# Altium project Charge Controller.PrjPcb
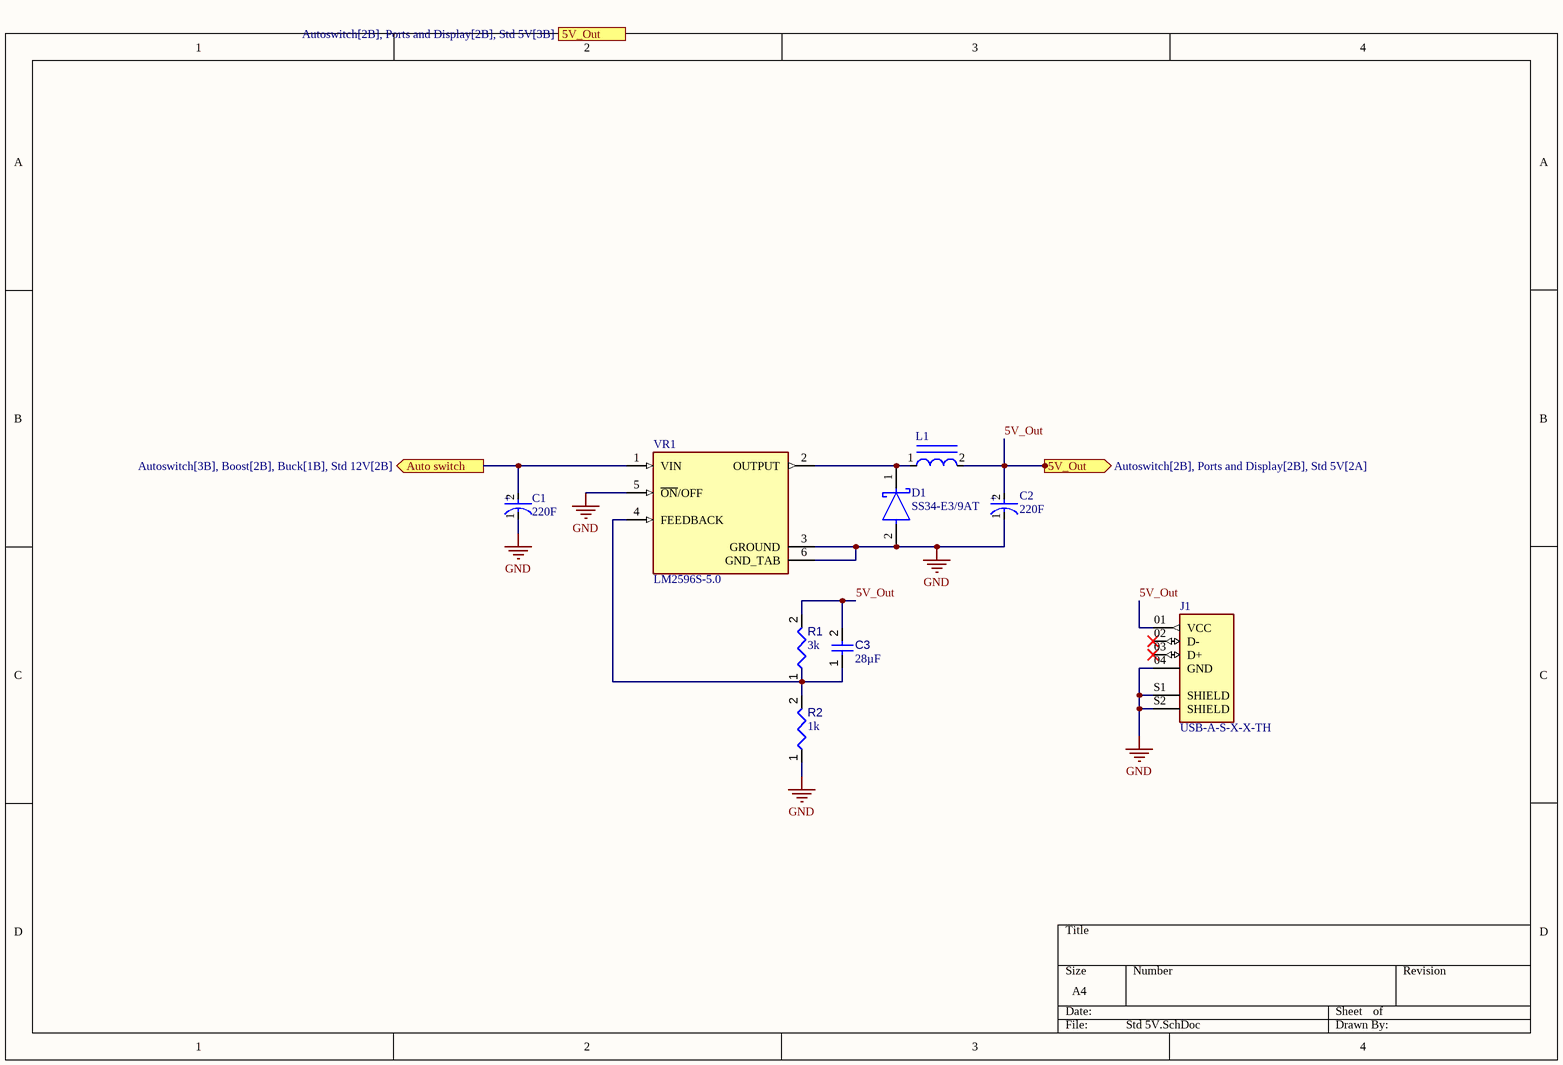
[diagram p0: Std 5V.SchDoc]
6 sheets, 49 parts. Net scope: flat (ports and power ports of the same name join across sheets).
Board file: Layout.PcbDoc
Sheets:
  Std 5V.SchDoc
  Buck.SchDoc
  Autoswitch.SchDoc
  Boost.SchDoc
  Ports and Display.SchDoc
  Std 12V.SchDoc

## Sheet Std 5V.SchDoc
size A4; SheetNumber: 1; SheetTotal: 6

### Parts
C1  value 220F  [FP-FTF-MFG]  (hidden comment: Capacitors)
C2  value 220F  [FP-FTF-MFG]  (hidden comment: Capacitors)
C3  value 28µF  [CAPC0805(2012)145_L]  (hidden comment: Capacitor 47µF +/-40% 6.3V 0805)
D1  SS34-E3/9AT  [FP-SMC-MFG]
J1  USB-A-S-X-X-TH  [SAMTEC_USB-A-S-X-X-TH]
L1  DR127-330-R  [FP-DR127-MFG]  (value not drawn)
R1  value 3k  [RESC0805(2012)_L]  (hidden comment: 1KR5J)
R2  value 1k  [RESC0805(2012)_L]  (hidden comment: 1KR5J)
VR1  LM2596S-5.0  [TO170P1524X483-6N]

### Ports
5V_Out (out, see Autoswitch[2B], Ports and Display[2B], Std 5V[2A]), 5V_Out (out, see Autoswitch[2B], Ports and Display[2B], Std 5V[3B]), Auto switch (out, see Autoswitch[3B], Boost[2B], Buck[1B], Std 12V[2B])

### Nets
GND: C1.1(C) C2.1(C) D1.2(A) J1.04(GND) J1.S1(SHIELD) J1.S2(SHIELD) R2.1 VR1.3(GROUND) VR1.5(~{ON}/OFF) VR1.6(GND_TAB)
5V_Out: C2.2(A) C3.2 J1.01(VCC) L1.2 R1.2 ; port 5V_Out
NetC1_2: C1.2(A) VR1.1(VIN) ; port Auto switch
NetC3_1: C3.1 R1.1 R2.2 VR1.4(FEEDBACK)
NetD1_1: D1.1(C) L1.1 VR1.2(OUTPUT)

Not connected (* = marked no-connect by the designer): J1 02(D-)* 03(D+)*

### Notes on the sheet
- (in symbol CMP-001-00083-1) +

### Library data of the parts
C1 C2 = CMP-001-00083-1: Aluminum Electrolytic Capacitor, Polarized, Aluminum (wet), 50V, 20% +Tol, 20% -Tol, 220uF, Surface Mount, 3333; Dielectric Material: Aluminium; Ripple Current: 435.5mA; Tan Delta: 0.1; ESR (Equivalent Series Resistance): 180mR; Reference Standard: AEC-Q200; Leakage Current: 110uA; RoHS Compliant: Yes; Tolerance (fill in as +-): 20%; Length: 10.2mm; Rated DC Voltage (URdc): 50V; Min Operating Temperature: -55°C; Packaging: Tape and Reel; Max Operating Temperature: 105°C; Case/Package: 3333; Tolerance  (fill in as +-): 20%; Capacitor Type: Aluminium; Termination: Flat; Reach SVHC Compliant: Yes; Pins: 2; Polarity: Polarized; Package Style: SMTMeter; Mounting Technology: Surface Mount; Diameter: 8mm
C3 = CMP-001-00082-4: Chip Capacitor, 47µF +/-40%, 6.3V, 0805, Thickness 1.45 mm; Tolerance: 10%; Min Operating Temperature: -55°C; Max Operating Temperature: 85°C; Case/Package: 0805; Pins: 2; Mounting Technology: SMT; Voltage Rating: 6.3V
D1 = CMP-004-00032-1: Rectifier Diode, Schottky, 1 Phase, 1 Element, 3A, 40V V(RRM), Silicon, DO-214AB; Max Reverse Current: 500uA; Time @ Peak Reflow Temperature-Max (s): 40s; Case Connection: CATHODE; Qualification Status: Not Qualified; Non-rep Pk Forward Current-Max: 100A; Number of Phases: 1; Package Body Material: Plastic; Application(s): EFFICIENCY; Forward Voltage: 500mV; Diode Type: RECTIFIER; Max Output current: 3A; Peak Reflow Temperature (Cel): 260°C; Package Shape: Rectangular; Terminal Position: DUAL; Terminal Finish: Tin; Min Operating Temperature: -55°C; Max Operating Temperature: 150°C; Diode Element Material: SILICON; Package Style: SMALL OUTLINEMeter; Technology: SCHOTTKY; Number of Elements: 1; Moisture Sensitivity Level: 1; Surface Mount: Yes; JESD-30 Code: R-PDSO-C2; RoHS Compliant: Yes; Rep Pk Reverse Voltage-Max: 40V; Terminal Form: C BEND; Pins: 2; JESD-609 Code: e3; JEDEC-95 Code: DO-214AB; Reach SVHC Compliant: No
J1 = CMP-035-000000-2: USB Connectors USB 2.0 Interface, Type A; MF: Samtec; MP: USB-A-S-F-B-TH-TR; Check_prices: https://www.snapeda.com/parts/USB-A-S-F-B-TH-TR/Samtec/view-part/?ref=eda; Purchase-URL: https://pricing.snapeda.com/search/part/USB-A-S-F-B-TH-TR/?ref=eda; SnapEDA_Link: https://www.snapeda.com/parts/USB-A-S-F-B-TH-TR/Samtec/view-part/?ref=snap; Design Item ID: USB-A-S-X-X-TH; Value: *; Component Type: Standard; Package: None; Source: USB-A-S-X-X-TH.SchLib; Availability: In Stock; Price: None; Pin Count: 6
L1 = CMP-006-00021-1: General Purpose Inductor, 33uH, 20%, 1 Element, Ferrite-Core, SMD, 4949; Package Width: 12.5mm; Case/Size Code: 4949; Shape/Size Description: RECTANGULAR PACKAGE; Inductor Application: DC-DC CONVERTER; Channels: 1; Test Frequency: 100kHz; Package Height: 8mm; Shielding: Shielded; Max Current Rating: 3.23A; DC Resistance (DCR): 60mR; Reach SVHC Compliant: Yes; Surface Mount: Yes; Max Operating Temperature: 125°C; Terminal Placement: Dual Ended; JESD-609 Code: e3; Package Style: SMTMeter; Inductance-Nom (L): 33uH; Package Length: 12.5mm; Tolerance: 20%; RoHS Compliant: Yes; Termination: One Surface; Inductor Type: GENERAL PURPOSE INDUCTOR; Pins: 2; Core Material: Ferrite; Terminal Finish: Nickel; Min Operating Temperature: -40°C; Packaging: Tape and Reel; Construction: Magnetic Shielded
R1 R2 = CMP-009-00076-2: 1K 0.125W 5% 0805 (2012 Metric)  SMD; Power: 125mW; Pins: 2; Mounting Technology: SMT; Tolerance: 5%; Case/Package: 0805
VR1 = CMP-003-000000-1: SIMPLE SWITCHER&reg; 4.5V to 40V, 3A Low Component Count Step-Down Regulator; MF: Texas Instruments; MP: LM2596S-5.0/NOPB; Source: LM2596S-5.0.SchLib; Component Type: Standard; Package: TO-263-5 Texas Instruments; Check_prices: https://www.snapeda.com/parts/LM2596S-5.0/NOPB/Texas+Instruments/view-part/?ref=eda; Value: *; Availability: In Stock; SnapEDA_Link: https://www.snapeda.com/parts/LM2596S-5.0/NOPB/Texas+Instruments/view-part/?ref=snap; Design Item ID: LM2596S-5.0; Pin Count: 6; Purchase-URL: https://pricing.snapeda.com/search/part/LM2596S-5.0/NOPB/?ref=eda; Price: None

## Sheet Buck.SchDoc
size A4; SheetNumber: 2; SheetTotal: 6
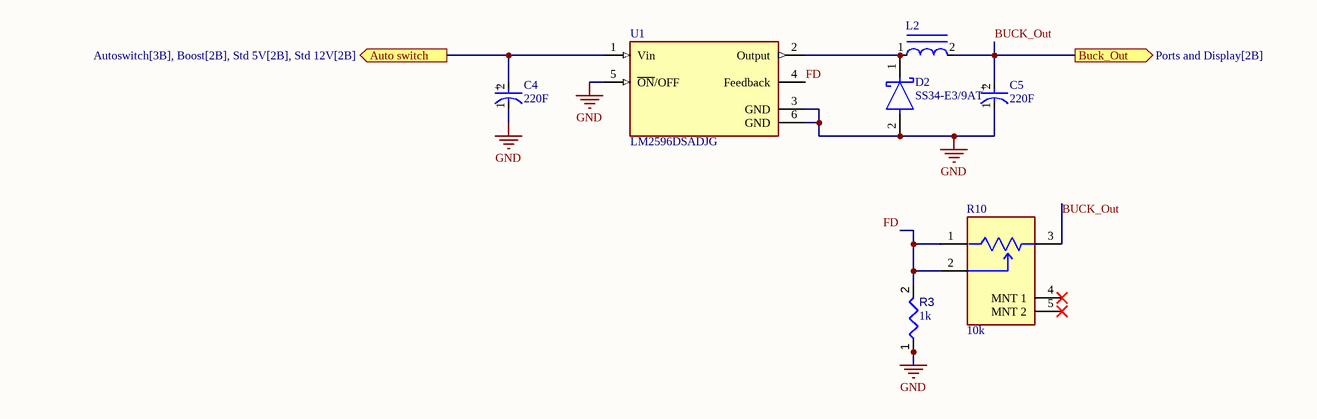
[diagram p1: Buck.SchDoc]

### Parts
C4  value 220F  [FP-FTF-MFG]  (hidden comment: Capacitors)
C5  value 220F  [FP-FTF-MFG]  (hidden comment: Capacitors)
D2  SS34-E3/9AT  [FP-SMC-MFG]
L2  DR127-330-R  [FP-DR127-MFG]  (value not drawn)
R3  value 1k  [RESC0805(2012)_L]  (hidden comment: 1KR5J)
R10  value 10k  [FP-PTV09A-4-MFG]  (hidden comment: PTV09A-4225F-B103)
U1  LM2596DSADJG  [FP-936A-02-MFG]

### Ports
Auto switch (out, see Autoswitch[3B], Boost[2B], Std 5V[2B], Std 12V[2B]), Buck_Out (out, see Ports and Display[2B])

### Nets
GND: C4.1(C) C5.1(C) D2.2(A) R3.1 U1.3(GND) U1.5(~{ON}/OFF) U1.6(GND)
BUCK_Out: C5.2(A) L2.2 R10.3 ; port Buck_Out
FD: R3.2 R10.1 R10.2 U1.4(Feedback)
NetC1_2: C4.2(A) U1.1(Vin) ; port Auto switch
NetD2_1: D2.1(C) L2.1 U1.2(Output)

Not connected (* = marked no-connect by the designer): R10 4(MNT_1)* 5(MNT_2)*

### Notes on the sheet
- (in symbol CMP-001-00083-1) +

### Library data of the parts
C4 C5 = CMP-001-00083-1: as C1 on sheet Std 5V; RoHS Compliant: Yes; Tolerance (fill in as +-): 20%; Length: 10.2mm; Rated DC Voltage (URdc): 50V; Min Operating Temperature: -55°C; Packaging: Tape and Reel; Max Operating Temperature: 105°C; Case/Package: 3333; Tolerance  (fill in as +-): 20%; Capacitor Type: Aluminium; Termination: Flat; Reach SVHC Compliant: Yes; Pins: 2; Polarity: Polarized; Package Style: SMTMeter; Mounting Technology: Surface Mount; Diameter: 8mm
D2 = CMP-004-00032-1: as D1 on sheet Std 5V; Diode Type: RECTIFIER; Max Output current: 3A; Peak Reflow Temperature (Cel): 260°C; Package Shape: Rectangular; Terminal Position: DUAL; Terminal Finish: Tin; Min Operating Temperature: -55°C; Max Operating Temperature: 150°C; Diode Element Material: SILICON; Package Style: SMALL OUTLINEMeter; Technology: SCHOTTKY; Number of Elements: 1; Moisture Sensitivity Level: 1; Surface Mount: Yes; JESD-30 Code: R-PDSO-C2; RoHS Compliant: Yes; Rep Pk Reverse Voltage-Max: 40V; Terminal Form: C BEND; Pins: 2; JESD-609 Code: e3; JEDEC-95 Code: DO-214AB; Reach SVHC Compliant: No
L2 = CMP-006-00021-1: as L1 on sheet Std 5V; Reach SVHC Compliant: Yes; Surface Mount: Yes; Max Operating Temperature: 125°C; Terminal Placement: Dual Ended; JESD-609 Code: e3; Package Style: SMTMeter; Inductance-Nom (L): 33uH; Package Length: 12.5mm; Tolerance: 20%; RoHS Compliant: Yes; Termination: One Surface; Inductor Type: GENERAL PURPOSE INDUCTOR; Pins: 2; Core Material: Ferrite; Terminal Finish: Nickel; Min Operating Temperature: -40°C; Packaging: Tape and Reel; Construction: Magnetic Shielded
R3 = CMP-009-00076-2: as R1 on sheet Std 5V; Pins: 2; Mounting Technology: SMT; Tolerance: 5%; Case/Package: 0805
R10 = CMP-009-00177-1: Potentiometer, Carbon, 0.05W, 10000ohm, 20V, 20% +/-Tol, 3943; Package Length: 9.8mm; Rotational Angle: 280°; Package Width: 11mm; Package Height: 6.8mm; Power: 50mW; Min Operating Temperature: -10°C; JESD-609 Code: e3; Max Operating Temperature: 50°C; Tolerance: 20%; Terminal Finish: Copper; Construction: SQUARE; Case/Package: 3943; Reach SVHC Compliant: Yes; Working Voltage: 20V; RoHS Compliant: Yes; Technology: CARBON; Resistor Type: Potentiometer
U1 = CMP-019-00050-1: Switching Regulator, Voltage-mode, 7.5A, 180kHz Switching Freq-Max, PSSO5; Nominal Output Voltage: 5V; Qualification Status: Not Qualified; Switcher Configuration: BUCK; Min Input Voltage: 4.5V; Package Equivalence Code: SMSIP5H,.6,67TB; Package Body Material: Plastic; Channels: 1; Max Supply Voltage: 40V; Nominal Supply Voltage: 12V; Min Operating Temperature: -40°C; Package Shape: Rectangular; Terminal Finish: Tin; Moisture Sensitivity Level: 1; JESD-30 Code: R-PSSO-G5; Max Operating Temperature: 125°C; Terminal Form: Gull Wing; Temperature Grade: AUTOMOTIVE; Reach SVHC Compliant: No; JESD-609 Code: e3; Control Mode: VOLTAGE-MODE; Terminal Position: SINGLE; Package Style: SMALL OUTLINEMeter; Throw Configuration: SWITCHING REGULATOR; Terminal Pitch: 1.702mm; Surface Mount: Yes; Width: 9.1945mm; RoHS Compliant: Yes; Max Output current: 7.5A; Length: 10.02mm; Pins: 5; Frequency: 180kHz; Case/Package: HSOP

## Sheet Autoswitch.SchDoc
size A4; SheetNumber: 3; SheetTotal: 6
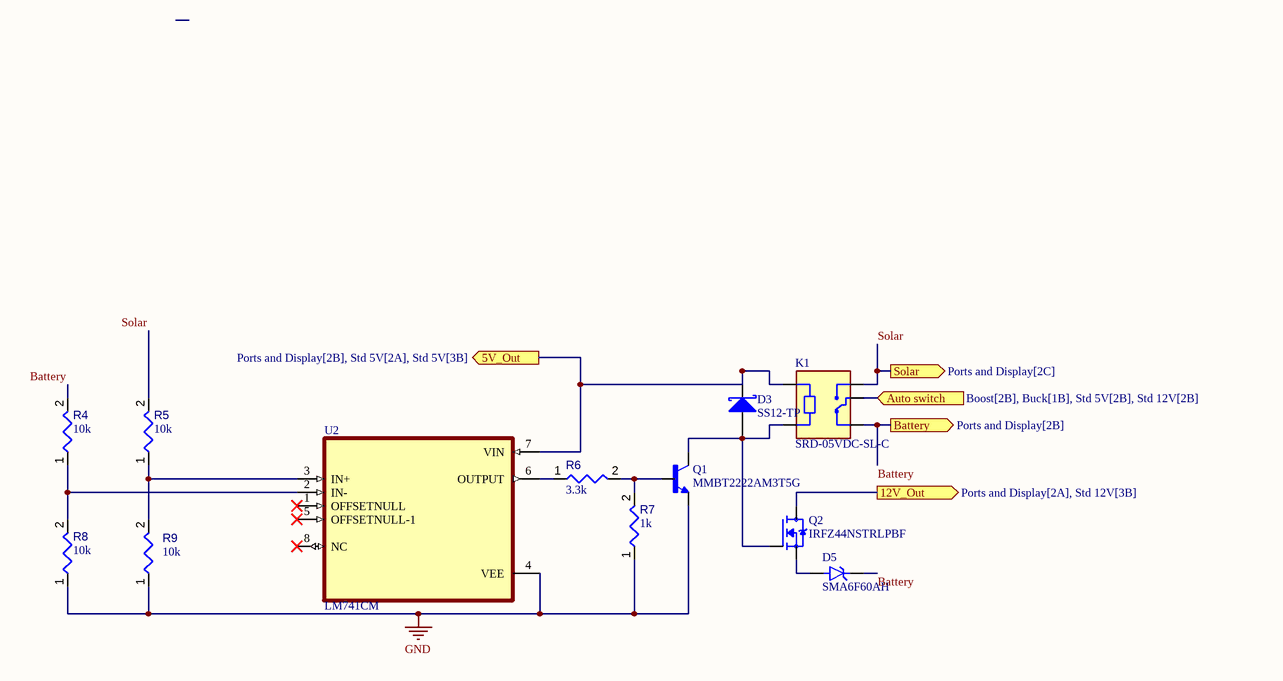
[diagram p2: Autoswitch.SchDoc]

### Parts
D3  SS12-TP  [MCC-DO-214AC-2_V]
D5  SMA6F60AH  [SODFL5226X100N]
K1  SRD-05VDC-SL-C  [RELAY_SRD-05VDC-SL-C]
Q1  MMBT2222AM3T5G  [SOT95P240X120-3N]
Q2  IRFZ44NSTRLPBF  [DPAK254P1524X483-3N]
R4  value 10k  [RESC0805(2012)_L]  (hidden comment: 1KR5J)
R5  value 10k  [RESC0805(2012)_L]  (hidden comment: 1KR5J)
R6  value 3.3k  [RESC0805(2012)_L]  (hidden comment: 1KR5J)
R7  value 1k  [RESC0805(2012)_L]  (hidden comment: 1KR5J)
R8  value 10k  [RESC0805(2012)_L]  (hidden comment: 1KR5J)
R9  value 10k  [RESC0805(2012)_L]  (hidden comment: 1KR5J)
U2  LM741CM  [SOIC127P599X175-8N]

### Ports
5V_Out (out, see Ports and Display[2B], Std 5V[2A], Std 5V[3B]), 12V_Out (out, see Ports and Display[2A], Std 12V[3B]), Auto switch (in, see Boost[2B], Buck[1B], Std 5V[2B], Std 12V[2B]), Battery (out, see Ports and Display[2B]), Solar (out, see Ports and Display[2C])

### Nets
GND: Q1.2(E) R7.1 R8.1 R9.1 U2.4(VEE)
5V_Out: D3.2(K) K1.A1 U2.7(VIN) ; port 5V_Out
12V_Out: Q2.2(D) ; port 12V_Out
Battery: D5.1(K) K1.NC R4.2 ; port Battery
Solar: K1.NO R5.2 ; port Solar
NetC1_2: K1.COM ; port Auto switch
NetD3_1: D3.1(A) K1.A2 Q1.3(C) Q2.1(G)
NetD5_2: D5.2(A) Q2.3(S)
NetQ1_1: Q1.1(B) R6.2 R7.2
NetR4_1: R4.1 R8.2 U2.2(IN-)
NetR5_1: R5.1 R9.2 U2.3(IN+)
NetR6_1: R6.1 U2.6(OUTPUT)

Not connected (* = marked no-connect by the designer): U2 1(OFFSETNULL)* 5(OFFSETNULL-1)* 8(NC)*

### Library data of the parts
D3 = CMP-004-00018-2: Schottky Rectifier, 20 V, 1 A, -55 to 125 degC, 2-Pin DO-214AC, RoHS, Tape and Reel; Manufacturer: Micro Commercial Components; Forward Voltage: 450mV; Max Surge Current: 30A; Forward Current: 1A; Peak Reverse Current: 500uA; Package Quantity: 1; Packaging: CutTape; Datasheet Version: Rev. B, 11/2011; Manufacturer URL: http://www.mccsemi.com/; Max Operating Temperature: 125°C; Pins: 2; Min Operating Temperature: -55°C; Package Reference: DO-214AC-2; Case/Package: SMA; Package Description: 2-Pin Molded Diode, Body 4.315 x 2.705 mm; Mounting Technology: SM; Datasheet URL: http://www.mccsemi.com/up_pdf/SS12-SS110(HSMA).PDF; RoHS Compliant: True
D5 = CMP-004-00031-1: 600W, 70.6V, 5%, Unidirectional, TVS; MF: Taiwan Semiconductor; Design Item ID: SMA6F60AH; Value: *; Case/Package: THIN SMA-2 Taiwan Semiconductor; Source: SMA6F60AH.SchLib; MP: SMA6F60AH; Component Type: Standard; SnapEDA_Link: https://www.snapeda.com/parts/SMA6F60AH/taiwan/view-part/?ref=snap; Check_prices: https://www.snapeda.com/parts/SMA6F60AH/taiwan/view-part/?ref=eda; Pins: 2
K1 = CMP-015-000000-1: 5V Trigger Relay Module For Arduino And Raspberry Pi 5V Trigger Relay Module For Arduino And Raspberry Pi; MF: Songle Relay; Check_prices: https://www.snapeda.com/parts/SRD-05VDC-SL-C/Songle+Relay/view-part/?ref=eda; Value: *; Pin Count: 5; Availability: Not in stock; Design Item ID: SRD-05VDC-SL-C; SnapEDA_Link: https://www.snapeda.com/parts/SRD-05VDC-SL-C/Songle+Relay/view-part/?ref=snap; Source: SRD-05VDC-SL-C.SchLib; Package: NON STANDARD-5 Songle Relay; Component Type: Standard; MP: SRD-05VDC-SL-C; Price: None
Q1 = CMP-017-000000-2: BJT, SOT-23, 40V, 600mA, NPN, 0.25W, 150°C; MF: Diotec Semiconductor; Design Item ID: MMBT2222A; Check_prices: https://www.snapeda.com/parts/MMBT2222A/Diotec/view-part/?ref=eda; MP: MMBT2222A; Component Type: Standard; Pin Count: 3; Source: MMBT2222A.SchLib; Value: *; SnapEDA_Link: https://www.snapeda.com/parts/MMBT2222A/Diotec/view-part/?ref=snap; Package: SOT-23 Diotec
Q2 = CMP-027-000000-1: RoHS Compliant; MF: Infineon Technologies; SnapEDA_Link: https://www.snapeda.com/parts/IRFZ44NSTRLPBF/Infineon+Technologies/view-part/?ref=snap; MP: IRFZ44NSTRLPBF; Pin Count: 3; Source: IRFZ44NSTRLPBF.SchLib; Package: D2PAK Infineon; Value: *; Component Type: Standard; Design Item ID: IRFZ44NSTRLPBF; Check_prices: https://www.snapeda.com/parts/IRFZ44NSTRLPBF/Infineon+Technologies/view-part/?ref=eda
R4-R9 = CMP-009-00076-2: as R1 on sheet Std 5V; Pins: 2; Mounting Technology: SMT; Tolerance: 5%; Case/Package: 0805
U2 = CMP-014-00005-1: General Purpose Amplifier 1 Circuit 8-SOIC; MF: Fairchild Semiconductor; Design Item ID: LM741CM; Value: *; SnapEDA_Link: https://www.snapeda.com/parts/LM741CM/Fairchild+Imaging/view-part/?ref=snap; Check_prices: https://www.snapeda.com/parts/LM741CM/Fairchild+Imaging/view-part/?ref=eda; Pins: 8; Component Type: Standard; Source: LM741CM.SchLib; Case/Package: SOIC-8 ON Semiconductor; MP: LM741CM

## Sheet Boost.SchDoc
size A4; SheetNumber: 4; SheetTotal: 6
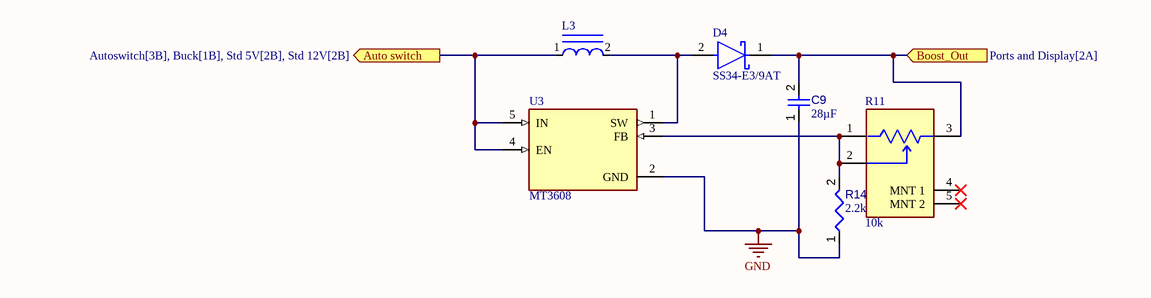
[diagram p3: Boost.SchDoc]

### Parts
C9  value 28µF  [CAPC0805(2012)145_L]  (hidden comment: Capacitor 47µF +/-40% 6.3V 0805)
D4  SS34-E3/9AT  [FP-SMC-MFG]
L3  DR127-330-R  [FP-DR127-MFG]  (value not drawn)
R11  value 10k  [FP-PTV09A-4-MFG]  (hidden comment: PTV09A-4225F-B103)
R14  value 2.2k  [RESC0805(2012)_L]  (hidden comment: 1KR5J)
U3  MT3608  [SOT95P280X145-6N]

### Ports
Auto switch (out, see Autoswitch[3B], Buck[1B], Std 5V[2B], Std 12V[2B]), Boost_Out (in, see Ports and Display[2A])

### Nets
GND: C9.1 R14.1 U3.2(GND)
Boost_Out: C9.2 D4.1(C) R11.3 ; port Boost_Out
NetC1_2: L3.1 U3.4(EN) U3.5(IN) ; port Auto switch
NetD4_2: D4.2(A) L3.2 U3.1(SW)
NetR11_1: R11.1 R11.2 R14.2 U3.3(FB)

Not connected (* = marked no-connect by the designer): R11 4(MNT_1)* 5(MNT_2)*

### Library data of the parts
C9 = CMP-001-00082-4: as C3 on sheet Std 5V; Min Operating Temperature: -55°C; Max Operating Temperature: 85°C; Case/Package: 0805; Pins: 2; Mounting Technology: SMT; Voltage Rating: 6.3V
D4 = CMP-004-00032-1: as D1 on sheet Std 5V; Diode Type: RECTIFIER; Max Output current: 3A; Peak Reflow Temperature (Cel): 260°C; Package Shape: Rectangular; Terminal Position: DUAL; Terminal Finish: Tin; Min Operating Temperature: -55°C; Max Operating Temperature: 150°C; Diode Element Material: SILICON; Package Style: SMALL OUTLINEMeter; Technology: SCHOTTKY; Number of Elements: 1; Moisture Sensitivity Level: 1; Surface Mount: Yes; JESD-30 Code: R-PDSO-C2; RoHS Compliant: Yes; Rep Pk Reverse Voltage-Max: 40V; Terminal Form: C BEND; Pins: 2; JESD-609 Code: e3; JEDEC-95 Code: DO-214AB; Reach SVHC Compliant: No
L3 = CMP-006-00021-1: as L1 on sheet Std 5V; Reach SVHC Compliant: Yes; Surface Mount: Yes; Max Operating Temperature: 125°C; Terminal Placement: Dual Ended; JESD-609 Code: e3; Package Style: SMTMeter; Inductance-Nom (L): 33uH; Package Length: 12.5mm; Tolerance: 20%; RoHS Compliant: Yes; Termination: One Surface; Inductor Type: GENERAL PURPOSE INDUCTOR; Pins: 2; Core Material: Ferrite; Terminal Finish: Nickel; Min Operating Temperature: -40°C; Packaging: Tape and Reel; Construction: Magnetic Shielded
R11 = CMP-009-00177-1: as R10 on sheet Buck; Min Operating Temperature: -10°C; JESD-609 Code: e3; Max Operating Temperature: 50°C; Tolerance: 20%; Terminal Finish: Copper; Construction: SQUARE; Case/Package: 3943; Reach SVHC Compliant: Yes; Working Voltage: 20V; RoHS Compliant: Yes; Technology: CARBON; Resistor Type: Potentiometer
R14 = CMP-009-00076-2: as R1 on sheet Std 5V; Pins: 2; Mounting Technology: SMT; Tolerance: 5%; Case/Package: 0805
U3 = CMP-019-000000-1: High Efficiency 1.2MHz2A Step Up Converter; MF: Aerosemi Technology Co., Ltd; Availability: Not in stock; Design Item ID: MT3608; SnapEDA_Link: https://www.snapeda.com/parts/MT3608/Aerosemi+Technology+Co.%252C+Ltd/view-part/?ref=snap; Source: MT3608.SchLib; Pin Count: 5; Value: *; MP: MT3608; Package: Package; Check_prices: https://www.snapeda.com/parts/MT3608/Aerosemi+Technology+Co.%252C+Ltd/view-part/?ref=eda; Price: None; Component Type: Standard

## Sheet Ports and Display.SchDoc
size A4; SheetNumber: 5; SheetTotal: 6
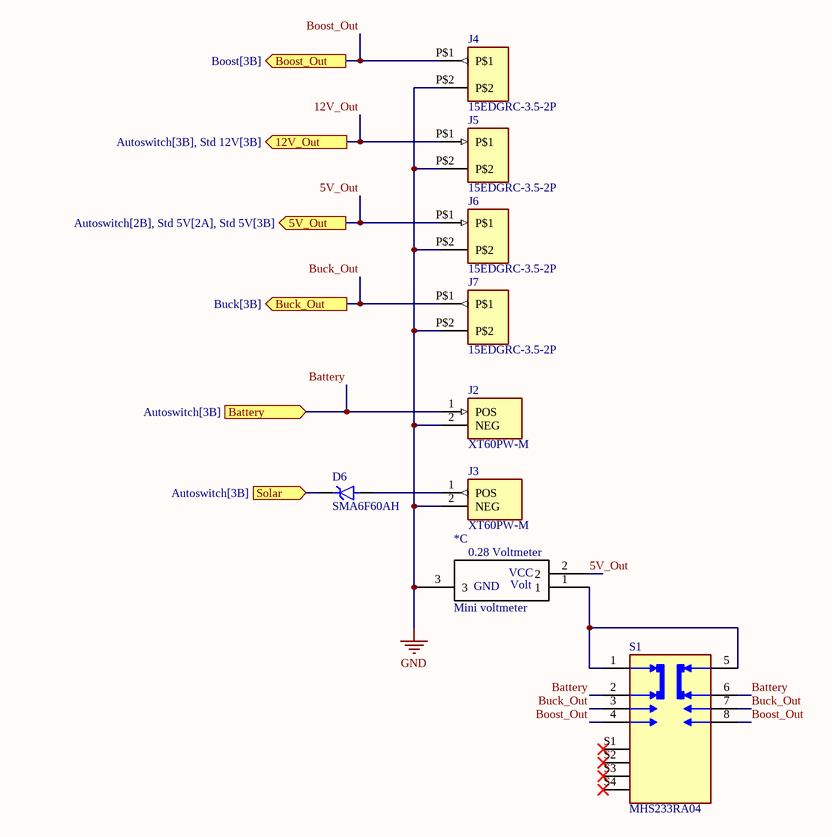
[diagram p4: Ports and Display.SchDoc]

### Parts
*  Mini voltmeter  [New footprint 1]  (part C of 3)
D6  SMA6F60AH  [SODFL5226X100N]
J2  XT60PW-M  [AMASS_XT60PW-M]
J3  XT60PW-M  [AMASS_XT60PW-M]
J4  15EDGRC-3.5-2P  [15EDGRC-3.5-2P-PAK]
J5  15EDGRC-3.5-2P  [15EDGRC-3.5-2P-PAK]
J6  15EDGRC-3.5-2P  [15EDGRC-3.5-2P-PAK]
J7  15EDGRC-3.5-2P  [15EDGRC-3.5-2P-PAK]
S1  MHS233RA04  [SW_MHS233RA04]

### Ports
5V_Out (out, see Autoswitch[2B], Std 5V[2A], Std 5V[3B]), 12V_Out (out, see Autoswitch[3B], Std 12V[3B]), Battery (in, see Autoswitch[3B]), Boost_Out (out, see Boost[3B]), Buck_Out (out, see Buck[3B]), Solar (in, see Autoswitch[3B])

### Nets
GND: *.3 J2.2(NEG) J3.2(NEG) J4.P$2 J5.P$2 J6.P$2 J7.P$2
5V_Out: *.2 J6.P$1 ; port 5V_Out
12V_Out: J5.P$1 ; port 12V_Out
Battery: J2.1(POS) S1.2 S1.6 ; port Battery
Boost_Out: J4.P$1 S1.4 S1.8 ; port Boost_Out
BUCK_Out: J7.P$1 S1.3 S1.7 ; port Buck_Out
Solar: D6.1(K) ; port Solar
Net*_1: *.1 S1.1 S1.5
NetD6_2: D6.2(A) J3.1(POS)

Not connected (* = marked no-connect by the designer): S1 S1(SHIELD)* S2(SHIELD)* S3(SHIELD)* S4(SHIELD)*

### Notes on the sheet
- (in symbol CMP-00002-3, part C) 0.28 Voltmeter; VCC; GND; Volt

### Library data of the parts
* = CMP-00002-3: 0-100V
D6 = CMP-004-00031-1: as D5 on sheet Autoswitch; Design Item ID: SMA6F60AH; Value: *; Case/Package: THIN SMA-2 Taiwan Semiconductor; Source: SMA6F60AH.SchLib; MP: SMA6F60AH; Component Type: Standard; SnapEDA_Link: https://www.snapeda.com/parts/SMA6F60AH/taiwan/view-part/?ref=snap; Check_prices: https://www.snapeda.com/parts/SMA6F60AH/taiwan/view-part/?ref=eda; Pins: 2
J2 J3 = CMP-002-00073-1: Socket, DC supply, male, PIN: 2; MF: AMASS; SnapEDA_Link: https://www.snapeda.com/parts/XT60PW-M/AMASS/view-part/?ref=snap; Design Item ID: XT60PW-M; MP: XT60PW-M; Pins: 2; Value: *; Check_prices: https://www.snapeda.com/parts/XT60PW-M/AMASS/view-part/?ref=eda; Availability: Not in stock; Component Type: Standard; Case/Package: Package; Source: XT60PW-M.SchLib; Price: None
J4-J7 = CMP-002-00077-2: Pluggable terminal block; socket; male; 3.5mm; angled 90Â°; ways: 2; MF: Degson; MP: 15EDGRC-3.5/2P; Pins: 2; Check_prices: https://www.snapeda.com/parts/15EDGRC-3.5/2P/Degson/view-part/?ref=eda; Case/Package: None; Component Type: Standard; Value: *; Source: 15EDGRC-3.5-2P.SchLib; Design Item ID: 15EDGRC-3.5-2P; SnapEDA_Link: https://www.snapeda.com/parts/15EDGRC-3.5/2P/Degson/view-part/?ref=snap
S1 = CMP-011-00013-1: Switch Slide ON ON ON DP3T Side Slide 0.3A 125VAC PC Pins Bracket Mount/Through Hole Tray; MF: TE Connectivity; MP: MHS233RA04; SnapEDA_Link: https://www.snapeda.com/parts/MHS233RA04/TE+Connectivity/view-part/?ref=snap; Component Type: Standard; Pins: 12; Value: *; Design Item ID: MHS233RA04; Case/Package: None; Source: MHS233RA04.SchLib; Check_prices: https://www.snapeda.com/parts/MHS233RA04/TE+Connectivity/view-part/?ref=eda

## Sheet Std 12V.SchDoc
size A4; SheetNumber: 6; SheetTotal: 6
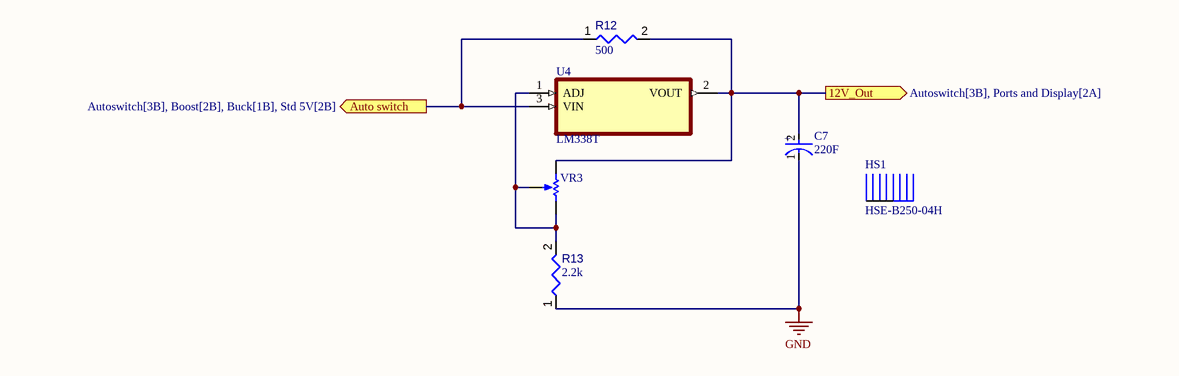
[diagram p5: Std 12V.SchDoc]

### Parts
C7  value 220F  [FP-FTF-MFG]  (hidden comment: Capacitors)
HS1  HSE-B250-04H  [HSINK_HSE-B250-04H]
R12  value 500  [RESC0805(2012)_L]  (hidden comment: 1KR5J)
R13  value 2.2k  [RESC0805(2012)_L]  (hidden comment: 1KR5J)
U4  LM338T  [TO254P1054X470X1955-3]
VR3  3362P-1-103LF  [BOUR-3362P]  (value not drawn)

### Ports
12V_Out (out, see Autoswitch[3B], Ports and Display[2A]), Auto switch (out, see Autoswitch[3B], Boost[2B], Buck[1B], Std 5V[2B])

### Nets
GND: C7.1(C) R13.1
12V_Out: C7.2(A) R12.2 U4.2(VOUT) VR3.1(CCW) ; port 12V_Out
NetC1_2: R12.1 U4.3(VIN) ; port Auto switch
NetHS1_1: HS1.1(S) HS1.2(S)
NetR13_2: R13.2 U4.1(ADJ) VR3.2(S) VR3.3(CW)

### Notes on the sheet
- (in symbol CMP-001-00083-1) +

### Library data of the parts
C7 = CMP-001-00083-1: as C1 on sheet Std 5V; RoHS Compliant: Yes; Tolerance (fill in as +-): 20%; Length: 10.2mm; Rated DC Voltage (URdc): 50V; Min Operating Temperature: -55°C; Packaging: Tape and Reel; Max Operating Temperature: 105°C; Case/Package: 3333; Tolerance  (fill in as +-): 20%; Capacitor Type: Aluminium; Termination: Flat; Reach SVHC Compliant: Yes; Pins: 2; Polarity: Polarized; Package Style: SMTMeter; Mounting Technology: Surface Mount; Diameter: 8mm
HS1 = CMP-029-000001-2: Extruded Heat Sink, TO-220, 4 mm Vertical Solder Pin; MF: Same Sky; Value: *; Component Type: Standard; Check_prices: https://www.snapeda.com/parts/HSE-B250-04H/Same+Sky/view-part/?ref=eda; Package: None; SnapEDA_Link: https://www.snapeda.com/parts/HSE-B250-04H/Same+Sky/view-part/?ref=snap; Pin Count: 2; Source: HSE-B250-04H.SchLib; Design Item ID: HSE-B250-04H; MP: HSE-B250-04H
R12 R13 = CMP-009-00076-2: as R1 on sheet Std 5V; Pins: 2; Mounting Technology: SMT; Tolerance: 5%; Case/Package: 0805
U4 = CMP-021-000000-1: 5-A, 40-V, low-IQ, adjustable linear voltage regulator 3-TO-220 0 to 125; MF: Texas Instruments; Source: LM338T.SchLib; Design Item ID: LM338T; Package: TO-220-3 Texas Instruments; Value: *; Pin Count: 3; MP: LM338T; Component Type: Standard; Check_prices: https://www.snapeda.com/parts/LM338T/Texas+Instruments/view-part/?ref=eda; SnapEDA_Link: https://www.snapeda.com/parts/LM338T/Texas+Instruments/view-part/?ref=snap
VR3 = CMP-009-00039-2: Square Trimpot(R) Trimming Potentiometer, 10 KOhm, 300 V, -55 to 125 degC, 3-Pin THD, RoHS, Tube; Manufacturer: Bourns; Tolerance: 10%; Power: 500mW; Voltage Rating: 300V; Resistance: 10k; Packaging: Rail/Tube; Package Reference: 3326P; Manufacturer URL: http://www.bourns.com/; Composition: Potentiometer; Package Description: 3-Pin Through Hole Device, Body 6.6 x 6.99 mm, Pitch 2.54 mm; Max Operating Temperature: 125°C; Min Operating Temperature: -55°C; Datasheet Version: May-16; Lead Pitch: 2.54mm; Pins: 3; Datasheet URL: http://www.bourns.com/docs/Product-Datasheets/3362.pdf; Package Quantity: 250; Case/Package: 3326P; RoHS Compliant: True; Mounting Technology: TH

## Nets that join several sheets
GND: Std 5V (10 pins), Buck (7 pins), Autoswitch (5 pins), Boost (C9.1 R14.1 U3.2), Ports and Display (7 pins), Std 12V (C7.1 R13.1)
5V_Out: Std 5V (5 pins), Autoswitch (D3.2 K1.A1 U2.7), Ports and Display (*.2 J6.P$1)
12V_Out: Autoswitch (Q2.2), Ports and Display (J5.P$1), Std 12V (C7.2 R12.2 U4.2 VR3.1)
Battery: Autoswitch (D5.1 K1.NC R4.2), Ports and Display (J2.1 S1.2 S1.6)
Boost_Out: Boost (C9.2 D4.1 R11.3), Ports and Display (J4.P$1 S1.4 S1.8)
BUCK_Out: Buck (C5.2 L2.2 R10.3), Ports and Display (J7.P$1 S1.3 S1.7)
NetC1_2: Std 5V (C1.2 VR1.1), Buck (C4.2 U1.1), Autoswitch (K1.COM), Boost (L3.1 U3.4 U3.5), Std 12V (R12.1 U4.3)
Solar: Autoswitch (K1.NO R5.2), Ports and Display (D6.1)